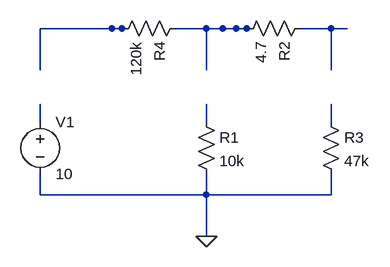
[diagram p0: schematic circuit.asc]
circuit.asc, the LTspice schematic file:
Version 4
SHEET 1 880 680
WIRE 448 400 448 372
WIRE 448 512 448 480
SYMBOL res 432 384 R0
SYMATTR InstName R1
SYMATTR Value 10k
WIRE 400 256 473 256
WIRE 302 256 318 256
SYMBOL res 416 240 R90
SYMATTR InstName R4
SYMATTR Value 120k
WIRE 592 256 665 256
WIRE 494 256 510 256
SYMBOL res 608 240 R90
SYMATTR InstName R2
SYMATTR Value 4.7
WIRE 640 400 640 372
WIRE 640 512 640 480
SYMBOL res 624 384 R0
SYMATTR InstName R3
SYMATTR Value 47k
FLAG 448 576 0
WIRE 192 400 192 372
WIRE 192 512 192 480
SYMBOL voltage 192 384 R0
SYMATTR InstName V1
SYMATTR Value 10
WIRE 640 256 640 320
WIRE 576 512 640 512
WIRE 448 512 448 576
WIRE 448 512 512 512
WIRE 384 512 448 512
WIRE 192 512 256 512
WIRE 192 256 192 320
WIRE 192 256 256 256
WIRE 448 256 448 320
WIRE 448 256 512 256
WIRE 256 256 320 256
WIRE 512 512 576 512
WIRE 320 512 384 512
WIRE 256 512 320 512

The netlist it stands for:
* circuit.asc
R1 N001 0 10k
R4 N002 N003 120k
R2 N004 N002 4.7
R3 N005 0 47k
V1 N006 0 10
.backanno
.end